# EAGLE design 6309 CPU Card Edge (EAGLE 4.16)
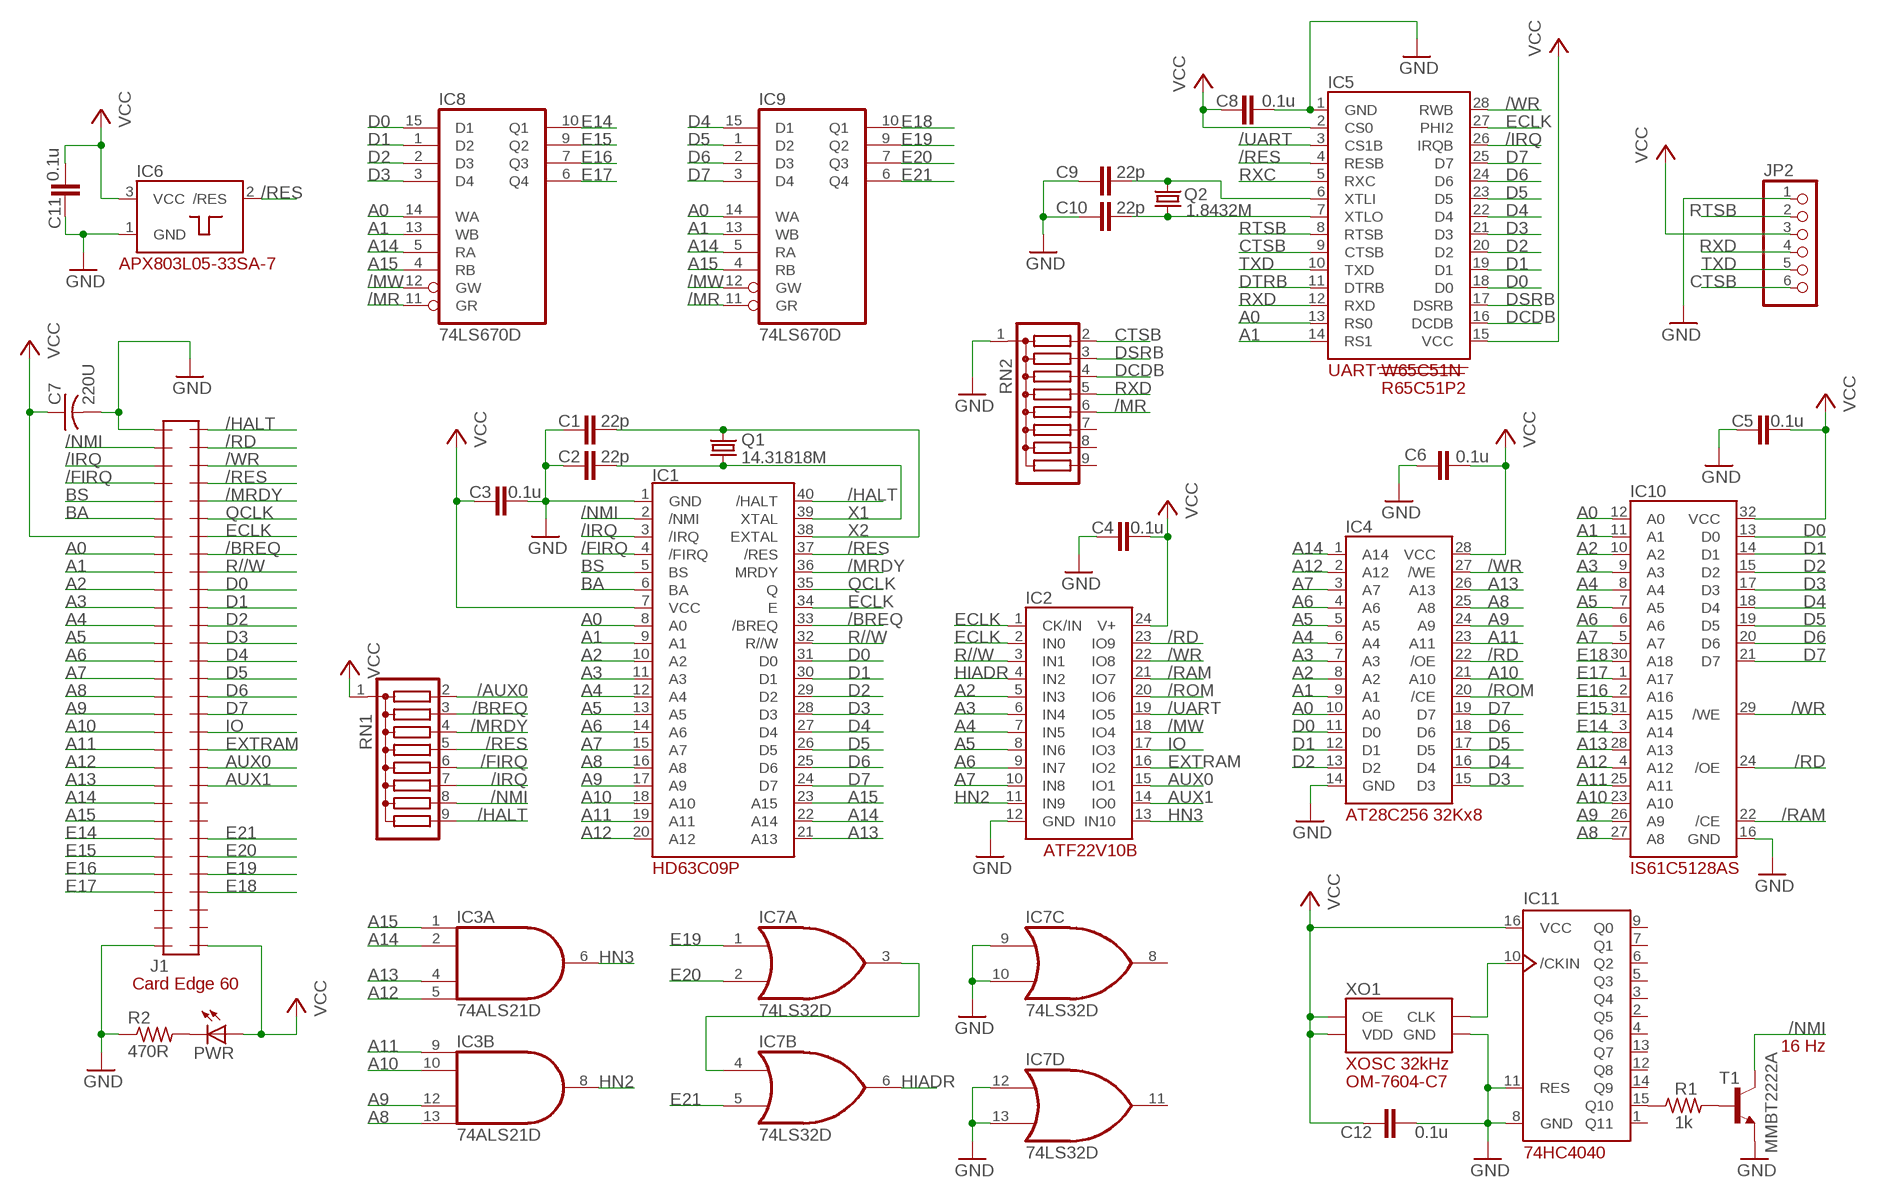
[diagram p0: schematic, sheet 1]

## Parts
C1  22p  C-EUC0603  [C0603]
C2  22p  C-EUC0603  [C0603]
C3  0.1u  C-EUC0603  [C0603]
C4  0.1u  C-EUC0603  [C0603]
C5  0.1u  C-EUC0603  [C0603]
C6  0.1u  C-EUC0603  [C0603]
C7  220U  C-US025-050X050  [C025-050X050]
C8  0.1u  C-EUC0603  [C0603]
C9  22p  C-EUC0603  [C0603]
C10  22p  C-EUC0603  [C0603]
C11  0.1u  C-EUC0603  [C0603]
C12  0.1u  C-EUC0603  [C0603]
IC1  HD63C09P  [DIL40]
IC2  PLD_ATF22V10B  [DIL24-3]
IC3  74ALS21D  [SO14]
IC4  EEP_32KX8_AT28C256  [DIL28-6]
IC5  UART_W65C51N  [DIL28-6]
IC6  POR_APX803L05-33SA-7  [SOT23]
IC7  74LS32D  [SO14]
IC8  74LS670D  [SO16]
IC9  74LS670D  [SO16]
IC10  IS61C5128AS  [SOIC32_11.3MM_WID]
IC11  74HC4040D  [SO16]
J1  CARDEDGE_2.54_60POS  [CARDEDGE_2.54_60POS]
JP2  PINHD-1X6  [1X06]
PWR  LED3MM  [LED3MM]
Q1  14.31818M  CRYSTALHC49S  [HC49/S]
Q2  1.8432M  CRYSTALHC49S  [HC49/S]
R1  1k  R-US_R0603  [R0603]
R2  470R  R-US_R0603  [R0603]
RN1  G08R  [SIL9]
RN2  G08R  [SIL9]
T1  MMBT2222A  MMBT2222ALT1-NPN-SOT23-BEC  [SOT23-BEC]
XO1  XODC_32KHZ_OM-7604-C7  [32K_XO_OM-7604-C7]

## Nets
/AUX0: RN1.2
/BREQ: IC1.33(/BREQ) J1.53 RN1.3
/FIRQ: IC1.4(/FIRQ) J1.4 RN1.6
/HALT: IC1.40(/HALT) J1.60 RN1.9
/IRQ: IC1.3(/IRQ) IC5.26(IRQB) J1.3 RN1.7
/MR: IC8.11(GR) IC9.11(GR) RN2.6
/MRDY: IC1.36(MRDY) J1.56 RN1.4
/MW: IC2.18(IO4) IC8.12(GW) IC9.12(GW)
/NMI: IC1.2(/NMI) J1.2 RN1.8 T1.C
/RAM: IC2.21(IO7) IC10.22(/CE)
/RD: IC2.23(IO9) IC4.22(/OE) IC10.24(/OE) J1.59
/RES: IC1.37(/RES) IC5.4(RESB) IC6.2(/RES) J1.57 RN1.5
/ROM: IC2.20(IO6) IC4.20(/CE)
/UART: IC2.19(IO5) IC5.3(CS1B)
/WR: IC2.22(IO8) IC4.27(/WE) IC5.28(RWB) IC10.29(/WE) J1.58
A0: IC1.8(A0) IC4.10(A0) IC5.13(RS0) IC8.14(WA) IC9.14(WA) IC10.12(A0) J1.8
A1: IC1.9(A1) IC4.9(A1) IC5.14(RS1) IC8.13(WB) IC9.13(WB) IC10.11(A1) J1.9
A2: IC1.10(A2) IC2.5(IN3) IC4.8(A2) IC10.10(A2) J1.10
A3: IC1.11(A3) IC2.6(IN4) IC4.7(A3) IC10.9(A3) J1.11
A4: IC1.12(A4) IC2.7(IN5) IC4.6(A4) IC10.8(A4) J1.12
A5: IC1.13(A5) IC2.8(IN6) IC4.5(A5) IC10.7(A5) J1.13
A6: IC1.14(A6) IC2.9(IN7) IC4.4(A6) IC10.6(A6) J1.14
A7: IC1.15(A7) IC2.10(IN8) IC4.3(A7) IC10.5(A7) J1.15
A8: IC1.16(A8) IC3.13(B:I3) IC4.25(A8) IC10.27(A8) J1.16
A9: IC1.17(A9) IC3.12(B:I2) IC4.24(A9) IC10.26(A9) J1.17
A10: IC1.18(A10) IC3.10(B:I1) IC4.21(A10) IC10.23(A10) J1.18
A11: IC1.19(A11) IC3.9(B:I0) IC4.23(A11) IC10.25(A11) J1.19
A12: IC1.20(A12) IC3.5(A:I3) IC4.2(A12) IC10.4(A12) J1.20
A13: IC1.21(A13) IC3.4(A:I2) IC4.26(A13) IC10.28(A13) J1.21
A14: IC1.22(A14) IC3.2(A:I1) IC4.1(A14) IC8.5(RA) IC9.5(RA) J1.22
A15: IC1.23(A15) IC3.1(A:I0) IC8.4(RB) IC9.4(RB) J1.23
AUX0: IC2.15(IO1) J1.41
AUX1: IC2.14(IO0) J1.40
BA: IC1.6(BA) J1.6
BS: IC1.5(BS) J1.5
CTSB: IC5.9(CTSB) JP2.6 RN2.2
D0: IC1.31(D0) IC4.11(D0) IC5.18(D0) IC8.15(D1) IC10.13(D0) J1.51
D1: IC1.30(D1) IC4.12(D1) IC5.19(D1) IC8.1(D2) IC10.14(D1) J1.50
D2: IC1.29(D2) IC4.13(D2) IC5.20(D2) IC8.2(D3) IC10.15(D2) J1.49
D3: IC1.28(D3) IC4.15(D3) IC5.21(D3) IC8.3(D4) IC10.17(D3) J1.48
D4: IC1.27(D4) IC4.16(D4) IC5.22(D4) IC9.15(D1) IC10.18(D4) J1.47
D5: IC1.26(D5) IC4.17(D5) IC5.23(D5) IC9.1(D2) IC10.19(D5) J1.46
D6: IC1.25(D6) IC4.18(D6) IC5.24(D6) IC9.2(D3) IC10.20(D6) J1.45
D7: IC1.24(D7) IC4.19(D7) IC5.25(D7) IC9.3(D4) IC10.21(D7) J1.44
DCDB: IC5.16(DCDB) RN2.4
DSRB: IC5.17(DSRB) RN2.3
DTRB: IC5.11(DTRB)
E14: IC8.10(Q1) IC10.3(A14) J1.24
E15: IC8.9(Q2) IC10.31(A15) J1.25
E16: IC8.7(Q3) IC10.2(A16) J1.26
E17: IC8.6(Q4) IC10.1(A17) J1.27
E18: IC9.10(Q1) IC10.30(A18) J1.34
E19: IC7.1(A:I0) IC9.9(Q2) J1.35
E20: IC7.2(A:I1) IC9.7(Q3) J1.36
E21: IC7.5(B:I1) IC9.6(Q4) J1.37
ECLK: IC1.34(E) IC2.1(CK/IN) IC2.2(IN0) IC5.27(PHI2) J1.54
EXTRAM: IC2.16(IO2) J1.42
GND [supply]: C1.1 C2.1 C3.2 C4.1 C5.1 C6.1 C7.2 C8.2 C9.1 C10.1 C11.2 C12.2 IC1.1(GND) IC2.12(GND) IC4.14(GND) IC5.1(GND) IC6.1(GND) IC7.9(C:I0) IC7.10(C:I1) IC7.12(D:I0) IC7.13(D:I1) IC10.16(GND) IC11.8(GND) IC11.11(RES) J1.1 J1.30 JP2.1 R2.1 RN2.1 T1.E XO1.GND
HIADR: IC2.4(IN2) IC7.6(B:O)
HN2: IC2.11(IN9) IC3.8(B:O)
HN3: IC2.13(IN10) IC3.6(A:O)
IO: IC2.17(IO3) J1.43
N$1: R1.2 T1.B
N$2: PWR.K(C) R2.2
N$3: IC11.15(Q10) R1.1
N$4: IC7.3(A:O) IC7.4(B:I0)
N$5: IC11.10(/CKIN) XO1.CKOUT(CLK)
N$20: C9.2 IC5.6(XTLI) Q2.2
N$21: C10.2 IC5.7(XTLO) Q2.1
QCLK: IC1.35(Q) J1.55
R//W: IC1.32(R//W) IC2.3(IN1) J1.52
RTSB: IC5.8(RTSB) JP2.2
RXC: IC5.5(RXC)
RXD: IC5.12(RXD) JP2.4 RN2.5
TXD: IC5.10(TXD) JP2.5
VCC [supply]: C3.1 C4.2 C5.2 C6.2 C7.1 C8.1 C11.1 C12.1 IC1.7(VCC) IC2.24(V+) IC4.28(VCC) IC5.2(CS0) IC5.15(VCC) IC6.3(VCC) IC10.32(VCC) IC11.16(VCC) J1.7 J1.31 JP2.3 PWR.A RN1.1 XO1.OE XO1.VDD
X1: C2.2 IC1.39(XTAL) Q1.1
X2: C1.2 IC1.38(EXTAL) Q1.2
Unconnected: IC7.8(C:O) IC7.11(D:O) IC11.1(Q11) IC11.2(Q5) IC11.3(Q4) IC11.4(Q6) IC11.5(Q3) IC11.6(Q2) IC11.7(Q1) IC11.9(Q0) IC11.12(Q8) IC11.13(Q7) IC11.14(Q9) J1.28 J1.29 J1.32 J1.33 J1.38 J1.39 RN2.7 RN2.8 RN2.9

## Notes on the sheet
- R65C51P2
- 16 Hz

## Power pins joined to a net without a drawn wire
GND: IC3.7(P:GND) IC7.7(P:GND) IC8.8(GND) IC9.8(GND)
VCC: IC3.14(P:VCC) IC7.14(P:VCC) IC8.16(VCC) IC9.16(VCC)

## Library data of the parts
C1-C6 C8-C12 = rcl:C-EU: CAPACITOR, European symbol
C7 = rcl:C-US: CAPACITOR, American symbol
IC1 = 07-Retrocomputing:HD63C09P
IC2 = 07-Retrocomputing:PLD_ATF22V10B
IC3 = 74xx-us:74*21: Dual 4-input AND gate
IC4 = 07-Retrocomputing:EEP_32KX8_AT28C256
IC5 = 07-Retrocomputing:UART_W65C51N
IC6 = 07-Retrocomputing:POR_APX803L05-33SA-7
IC7 = 74xx-us:74*32: Quad 2-input OR gate
IC8 IC9 = 74xx-us:74*670: 4 by 4 REGISTER FILES, 3-state
IC10 = 07-Retrocomputing:IS61C5128AS
IC11 = 07-Retrocomputing:74HC4040
J1 = 07-Retrocomputing:CARDEDGE_2.54_60POS
JP2 = pinhead:PINHD-1X6: PIN HEADER
PWR = led:LED: LED OSRAM: - CHIPLED LG R971, LG N971, LY N971, LG Q971, LY Q971, LO R971, LY R971 LH N974, LH R974 LS Q976, LO Q976, LY Q976 LO Q996 - Hyper CHIPLED LW Q18S LB Q993, LB Q99A, LB R99A - SideLED LS A670, LO A670, LY A670, LG A670, LP A670 LB A673, LV A673, LT A673, LW A673 LH A674 LY A675 LS A676, LA A676, LO A676, LY A676, LW A676 LS A679, LY A679, LG A679 - Hyper Micro SIDELED® LS Y876, LA Y876, LO Y876, LY Y876 LT Y87S - SmartLED LW L88C, LW L88S LB L89C, LB L89S, LG L890 LS L89K, LO L89K, LY L89K LS L896, LA L896, LO L896, LY L896 - TOPLED LS T670, LO T670, LY T670, LG T670, LP T670 LSG T670, LSP T670, LSY T670, LOP T670, LYG T670 LG T671, LOG T671, LSG T671 LB T673, LV T673, LT T673, LW T673 LH T674 LS T676, LA T676, LO T676, LY T676, LB T676, LH T676, LSB T676, LW T676 LB T67C, LV T67C, LT T67C, LS T67K, LO T67K, LY T67K, LW E67C LS E67B, LA E67B, LO E67B, LY E67B, LB E67C, LV E67C, LT E67C LW T67C LS T679, LY T679, LG T679 LS T770, LO T770, LY T770, LG T770, LP T770 LB T773, LV T773, LT T773, LW T773 LH T774 LS E675, LA E675, LY E675, LS T675 LS T776, LA T776, LO T776, LY T776, LB T776 LHGB T686 LT T68C, LB T68C - Hyper Mini TOPLED® LB M676 - Mini TOPLED Santana® LG M470 LS M47K, LO M47K, LY M47K Source: http://www.osram.convergy.de - LUMILED® LXK2-PW12-R00, LXK2-PW12-S00, LXK2-PW14-U00, LXK2-PW14-V00 LXK2-PM12-R00, LXK2-PM12-S00, LXK2-PM14-U00 LXK2-PE12-Q00, LXK2-PE12-R00, LXK2-PE12-S00, LXK2-PE14-T00, LXK2-PE14-U00 LXK2-PB12-K00, LXK2-PB12-L00, LXK2-PB12-M00, LXK2-PB14-N00, LXK2-PB14-P00, LXK2-PB14-Q00 LXK2-PR12-L00, LXK2-PR12-M00, LXK2-PR14-Q00, LXK2-PR14-R00 LXK2-PD12-Q00, LXK2-PD12-R00, LXK2-PD12-S00 LXK2-PH12-R00, LXK2-PH12-S00 LXK2-PL12-P00, LXK2-PL12-Q00, LXK2-PL12-R00 Source: www.luxeon.com
Q1 Q2 = crystal:CRYSTAL: CRYSTAL
R1 R2 = rcl:R-US_: RESISTOR, American symbol
RN1 RN2 = resistor-sil:G08R: SIL RESISTOR
T1 = transistor:*-NPN-: NPN Transistror
XO1 = 07-Retrocomputing:XODC_32KHZ_OM-7604-C7

## Net classes
0 default: width 0.203 mm, drill 0.203 mm, clearance 0.254 mm
1 supply: width 0.61 mm, drill 0.203 mm, clearance 0.305 mm

## Board
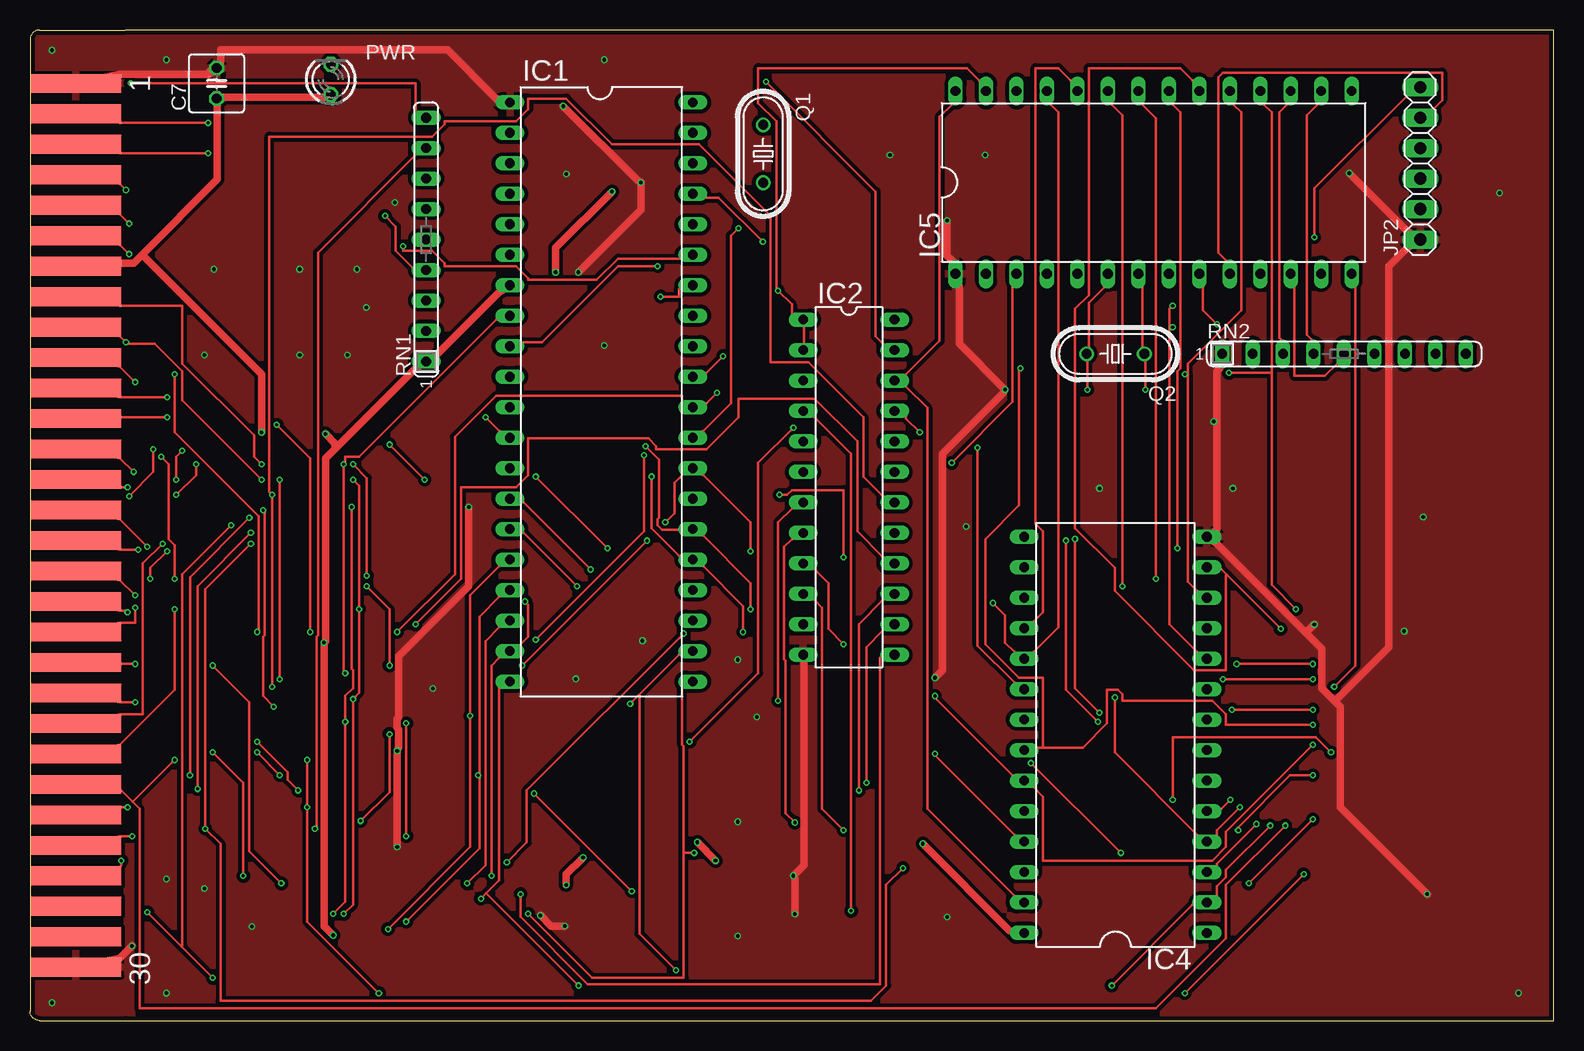
[diagram p1: board, top side]
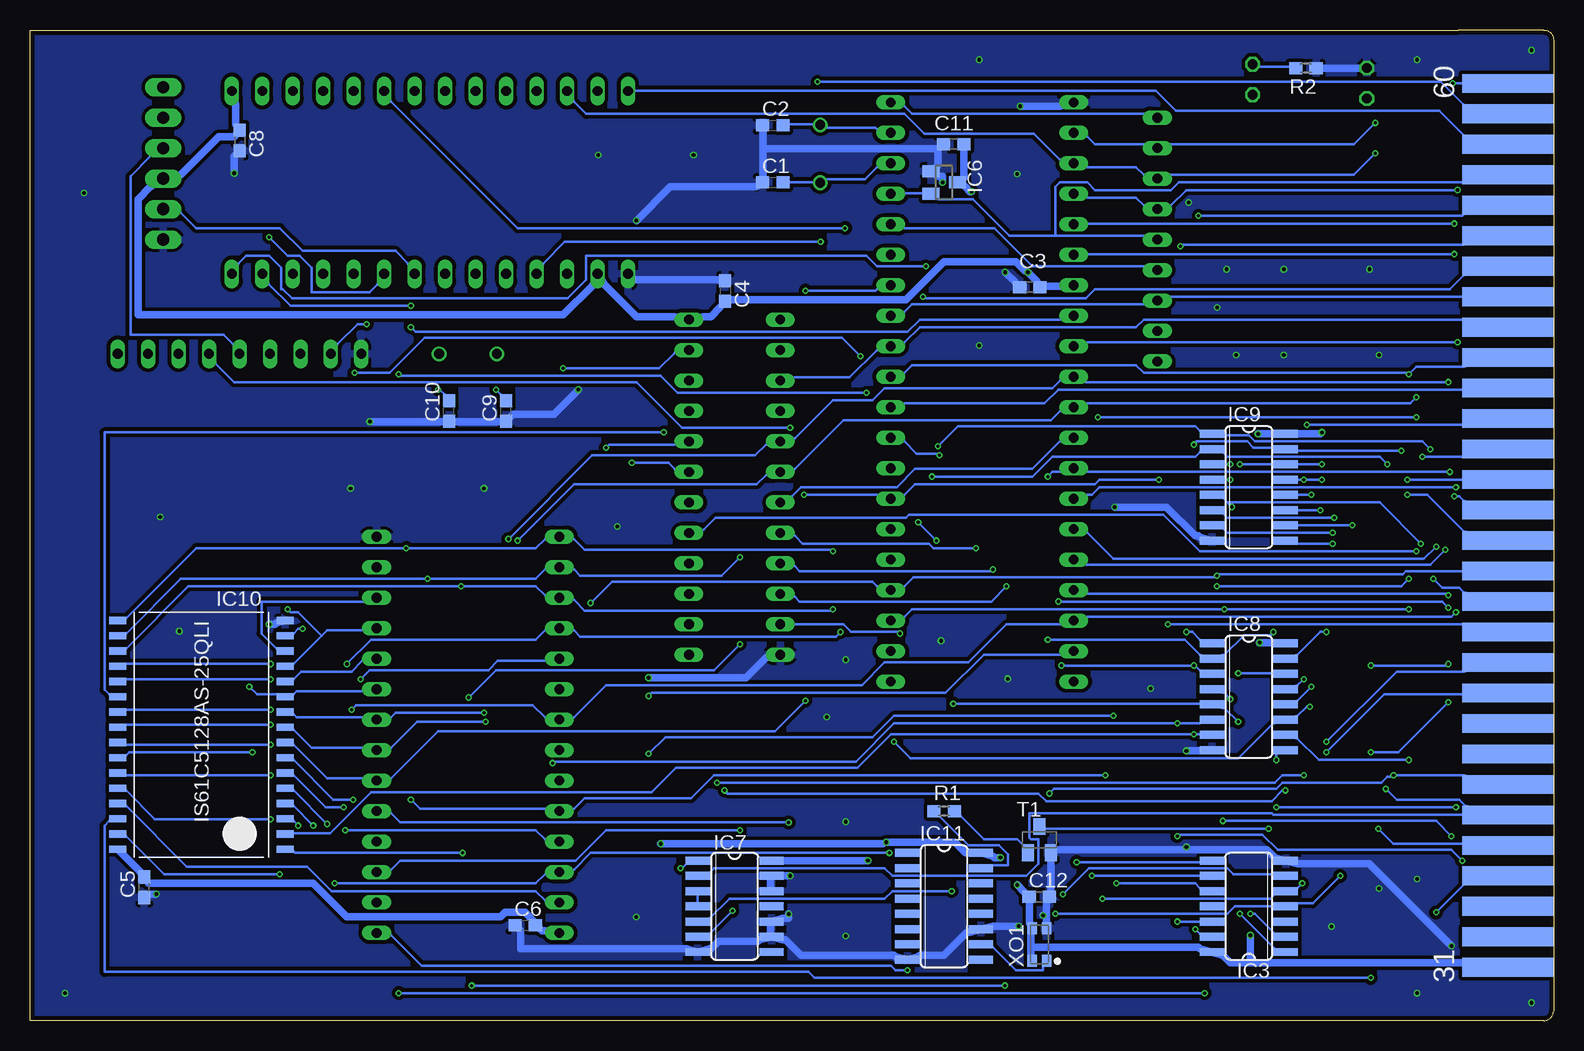
[diagram p2: board, bottom side, seen from below]

Size 127 x 82.55 mm. Coordinates in mm from the lower left corner, seen from the top.
Outline: 7.94,0 127,0 127,82.55 7.94,82.55
Copper layers (1*16): Top 0.0356mm / dielectric 1.6mm / Bottom 0.0356mm
Design rules "oshpark-2layer": minimum track width 6mil, minimum drill 10mil, track to track 6mil, track to pad 6mil, pad to pad 6mil, via to via 6mil, smd to smd 6mil, copper to edge 15mil, drill to drill 6mil, minimum pad ring 5mil, minimum via ring 5mil, stop-mask expansion 2.5mil, vias tented up to drill 0mil, thermal gap 10mil

### Footprints (pad centres in the part's own frame; a part is rotated, then mirrored left to right if it is on the bottom)
C0603 = smd 1.1 x 1: 1 -0.85,0; 2 0.85,0
C025-050X050 = drill 0.813 octagon: 1 -1.27,0; 2 1.27,0
DIL40 = drill 0.813 long: 1 -24.13,-7.62; 2 -21.59,-7.62; 3 -19.05,-7.62; 4 -16.51,-7.62; 5 -13.97,-7.62; 6 -11.43,-7.62; 7 -8.89,-7.62; 8 -6.35,-7.62; 9 -3.81,-7.62; 10 -1.27,-7.62; 11 1.27,-7.62; 12 3.81,-7.62; 13 6.35,-7.62; 14 8.89,-7.62; 15 11.43,-7.62; 16 13.97,-7.62; 17 16.51,-7.62; 18 19.05,-7.62; 19 21.59,-7.62; 20 24.13,-7.62; 21 24.13,7.62; 22 21.59,7.62; 23 19.05,7.62; 24 16.51,7.62; 25 13.97,7.62; 26 11.43,7.62; 27 8.89,7.62; 28 6.35,7.62; 29 3.81,7.62; 30 1.27,7.62; 31 -1.27,7.62; 32 -3.81,7.62; 33 -6.35,7.62; 34 -8.89,7.62; 35 -11.43,7.62; 36 -13.97,7.62; 37 -16.51,7.62; 38 -19.05,7.62; 39 -21.59,7.62; 40 -24.13,7.62
DIL24-3 = drill 0.813 long: 1 -13.97,-3.81; 2 -11.43,-3.81; 3 -8.89,-3.81; 4 -6.35,-3.81; 5 -3.81,-3.81; 6 -1.27,-3.81; 7 1.27,-3.81; 8 3.81,-3.81; 9 6.35,-3.81; 10 8.89,-3.81; 11 11.43,-3.81; 12 13.97,-3.81; 13 13.97,3.81; 14 11.43,3.81; 15 8.89,3.81; 16 6.35,3.81; 17 3.81,3.81; 18 1.27,3.81; 19 -1.27,3.81; 20 -3.81,3.81; 21 -6.35,3.81; 22 -8.89,3.81; 23 -11.43,3.81; 24 -13.97,3.81
SO14 = smd 0.66 x 2.032: 1 -3.81,-3.073; 2 -2.54,-3.073; 3 -1.27,-3.073; 4 0,-3.073; 5 1.27,-3.073; 6 2.54,-3.073; 7 3.81,-3.073; 8 3.81,3.073; 9 2.54,3.073; 10 1.27,3.073; 11 0,3.073; 12 -1.27,3.073; 13 -2.54,3.073; 14 -3.81,3.073
DIL28-6 = drill 0.813 long: 1 -16.51,-7.62; 2 -13.97,-7.62; 3 -11.43,-7.62; 4 -8.89,-7.62; 5 -6.35,-7.62; 6 -3.81,-7.62; 7 -1.27,-7.62; 8 1.27,-7.62; 9 3.81,-7.62; 10 6.35,-7.62; 11 8.89,-7.62; 12 11.43,-7.62; 13 13.97,-7.62; 14 16.51,-7.62; 15 16.51,7.62; 16 13.97,7.62; 17 11.43,7.62; 18 8.89,7.62; 19 6.35,7.62; 20 3.81,7.62; 21 1.27,7.62; 22 -1.27,7.62; 23 -3.81,7.62; 24 -6.35,7.62; 25 -8.89,7.62; 26 -11.43,7.62; 27 -13.97,7.62; 28 -16.51,7.62
SOT23 = smd 1 x 1.4: 1 -0.95,-1.1; 2 0.95,-1.1; 3 0,1.1
SO16 = smd 0.66 x 2.032: 1 -4.445,-3.073; 2 -3.175,-3.073; 3 -1.905,-3.073; 4 -0.635,-3.073; 5 0.635,-3.073; 6 1.905,-3.073; 7 3.175,-3.073; 8 4.445,-3.073; 9 4.445,3.073; 10 3.175,3.073; 11 1.905,3.073; 12 0.635,3.073; 13 -0.635,3.073; 14 -1.905,3.073; 15 -3.175,3.073; 16 -4.445,3.073
SOIC32_11.3MM_WID = smd 1.4 x 0.6: 1 -6.985,9.525; 2 -6.985,8.255; 3 -6.985,6.985; 4 -6.985,5.715; 5 -6.985,4.445; 6 -6.985,3.175; 7 -6.985,1.905; 8 -6.985,0.635; 9 -6.985,-0.635; 10 -6.985,-1.905; 11 -6.985,-3.175; 12 -6.985,-4.445; 13 -6.985,-5.715; 14 -6.985,-6.985; 15 -6.985,-8.255; 16 -6.985,-9.525; 17 6.985,-9.525; 18 6.985,-8.255; 19 6.985,-6.985; 20 6.985,-5.715; 21 6.985,-4.445; 22 6.985,-3.175; 23 6.985,-1.905; 24 6.985,-0.635; 25 6.985,0.635; 26 6.985,1.905; 27 6.985,3.175; 28 6.985,4.445; 29 6.985,5.715; 30 6.985,6.985; 31 6.985,8.255; 32 6.985,9.525
CARDEDGE_2.54_60POS = smd 1.556 x 7.62: 1 -36.83,3.81; 2 -34.29,3.81; 3 -31.75,3.81; 4 -29.21,3.81; 5 -26.67,3.81; 6 -24.13,3.81; 7 -21.59,3.81; 8 -19.05,3.81; 9 -16.51,3.81; 10 -13.97,3.81; 11 -11.43,3.81; 12 -8.89,3.81; 13 -6.35,3.81; 14 -3.81,3.81; 15 -1.27,3.81; 16 1.27,3.81; 17 3.81,3.81; 18 6.35,3.81; 19 8.89,3.81; 20 11.43,3.81; 21 13.97,3.81; 22 16.51,3.81; 23 19.05,3.81; 24 21.59,3.81; 25 24.13,3.81; 26 26.67,3.81; 27 29.21,3.81; 28 31.75,3.81; 29 34.29,3.81; 30 36.83,3.81 | smd 1.556 x 7.62 bottom: 31 36.83,3.81; 32 34.29,3.81; 33 31.75,3.81; 34 29.21,3.81; 35 26.67,3.81; 36 24.13,3.81; 37 21.59,3.81; 38 19.05,3.81; 39 16.51,3.81; 40 13.97,3.81; 41 11.43,3.81; 42 8.89,3.81; 43 6.35,3.81; 44 3.81,3.81; 45 1.27,3.81; 46 -1.27,3.81; 47 -3.81,3.81; 48 -6.35,3.81; 49 -8.89,3.81; 50 -11.43,3.81; 51 -13.97,3.81; 52 -16.51,3.81; 53 -19.05,3.81; 54 -21.59,3.81; 55 -24.13,3.81; 56 -26.67,3.81; 57 -29.21,3.81; 58 -31.75,3.81; 59 -34.29,3.81; 60 -36.83,3.81
1X06 = drill 1.016 long: 1 -6.35,0; 2 -3.81,0; 3 -1.27,0; 4 1.27,0; 5 3.81,0; 6 6.35,0
LED3MM = drill 0.813 octagon: A -1.27,0; K 1.27,0
HC49/S = drill 0.813 round: 1 -2.413,0; 2 2.413,0
R0603 = smd 1.1 x 1: 1 -0.85,0; 2 0.85,0
SIL9 = drill 0.813 long: 1 -10.16,0; 2 -7.62,0; 3 -5.08,0; 4 -2.54,0; 5 0,0; 6 2.54,0; 7 5.08,0; 8 7.62,0; 9 10.16,0
SOT23-BEC = smd 1 x 1.4: B -0.95,-1.1; C 0,1.1; E 0.95,-1.1
32K_XO_OM-7604-C7 = smd 1 x 0.8: CKOUT -1.35,-0.6; GND 1.35,-0.6; OE 1.35,0.6; VDD -1.35,0.6

### Placement (x,y rotation side)
C1  65.09,69.85 0 bottom
C2  65.09,74.61 0 bottom
C3  43.66,61.12 180 bottom
C4  69.06,60.8 270 bottom
C5  117.47,11.11 90 bottom
C6  85.72,7.94 0 bottom
C7  15.56,78.11 90 top
C8  109.54,73.34 270 bottom
C9  87.31,50.8 90 bottom
C10  92.08,50.8 90 bottom
C11  50.01,73.03 180 bottom
C12  42.86,10.32 0 bottom
IC1  47.62,52.39 270 top
IC2  68.26,44.45 270 top
IC3  25.4,9.53 90 bottom
IC4  90.49,23.81 90 top
IC5  93.66,69.85 0 top
IC6  50.8,69.85 270 bottom
IC7  68.26,9.53 270 bottom
IC8  25.4,26.99 270 bottom
IC9  25.4,44.45 270 bottom
IC10  112.71,23.81 180 bottom
IC11  50.8,9.53 270 bottom
J1  0,41.27 270 top
JP2  115.89,71.44 90 top
PWR  25.08,78.42 90 top
Q1  61.12,72.23 270 top
Q2  90.49,55.56 180 top
R1  50.8,17.46 0 bottom
R2  20.64,79.38 180 bottom
RN1  33.02,65.09 90 top
RN2  109.54,55.56 0 top
T1  42.86,15.08 0 bottom
XO1  42.86,6.35 90 bottom

### Tracks (layer width: path | path; a pad name or v marks a point on that pad's centre or on a via)
/BREQ
  Bottom 0.203: IC1.33 54.1,59.05 53.47,59.69 34.16,59.69 RN1.3 31.88,60.33 J1.53
/FIRQ  (via drill 0.25)
  Top 0.203: v8,69.22 7.49,69.72 J1.4
  Bottom 0.203: IC1.4 38.86,68.58 34.8,68.58 34.16,67.94 RN1.6 31.88,67.94 30.61,69.22 v8,69.22
/HALT  (via drill 0.25)
  Top 0.203: v8.38,78.11 32.13,78.11 32.13,75.82 RN1.9
  Bottom 0.203: RN1.9 34.16,75.56 53.47,75.56 54.1,76.2 IC1.40 | J1.60 v8.38,78.11
/IRQ  (via drill 0.25)
  Top 0.203: v14.86,72.26 7.49,72.26 J1.3
  Bottom 0.203: IC5.26 81.66,76.58 80.64,75.56 54.1,75.56 52.45,73.91 43.31,73.91 41.15,71.75 IC1.3 38.86,71.12 34.8,71.12 34.16,70.48 RN1.7 31.88,70.48 16.64,70.48 v14.86,72.26
/MR  (via drill 0.25)
  Top 0.203: v20.32,26.16 19.43,27.05 19.43,32 19.56,32.13 19.56,42.42 v19.43,42.55 | v63.63,49.4 60.71,46.48 60.71,28.96 v54.99,23.24
  Bottom 0.203: v20.32,26.16 20.57,26.16 21.34,25.4 IC8.11 23.24,24.77 23.37,24.77 26.29,21.84 53.59,21.84 v54.99,23.24 | v19.43,42.55 IC9.11 | v63.63,49.4 72.64,49.4 76.45,53.21 109.98,53.21 111.51,54.74 RN2.6
/MRDY  (via drill 0.25)
  Top 0.203: v29.59,67.06 30.48,66.17 30.48,64.14 31.88,62.74 RN1.4
  Bottom 0.203: RN1.4 34.16,62.87 43.43,62.87 46.61,66.04 54.1,66.04 IC1.36 | v29.59,67.06 7.62,67.06 7.49,67.18 J1.56
/MW  (via drill 0.25)
  Top 0.203: v20.19,27.81 v20.19,43.81 19.94,44.07 19.94,73.66 33.53,73.66 34.54,74.68 34.54,74.93 40.51,74.93 41.53,75.95 41.53,76.83 44.7,76.83 48.51,73.03 55.75,73.03 61.72,67.06 61.72,54.86 64.9,54.86 69.47,50.29 69.47,45.34 71.12,43.69 IC2.18
  Bottom 0.203: v20.19,27.81 21.34,26.67 IC8.12 | v20.19,43.81 IC9.12
/NMI  (via drill 0.25)
  Top 0.203: v23.75,16 23.88,16.13 23.88,32 24,32.13 24,64.01 32.13,72.14 RN1.8 | v14.86,74.8 7.49,74.8 J1.2
  Bottom 0.203: v23.75,16 42.42,16 T1.C | IC1.2 38.86,73.66 38.23,73.03 34.16,73.03 RN1.8 31.88,73.03 16.64,73.03 v14.86,74.8
/RAM  (via drill 0.25)
  Top 0.203: v74.17,49.02 73.03,50.16 73.03,50.29 IC2.21
  Bottom 0.203: v74.17,49.02 120.78,49.02 120.78,27.56 120.4,27.18 IC10.22
/RD  (via drill 0.25)
  Top 0.203: v106.93,24.64 99.69,24.64 99.69,25.53 98.55,26.67 91.06,26.67 91.06,27.18 90.68,27.56 89.79,27.56 89.79,24.77 87.76,22.73 84.45,22.73 | 84.45,22.73 84.07,22.73 IC4.22 | v82.55,54.36 82.42,54.23 82.42,42.93 79.63,40.13 79.63,31.37 82.42,28.57 84.45,28.57 84.45,22.73 | v61.34,78.23 70.48,69.09 70.48,57.02 71.12,56.39 IC2.23
  Bottom 0.203: v106.93,24.64 119,24.64 IC10.24 | v82.55,54.36 74.55,54.36 73.28,55.63 IC2.23 | v61.34,78.23 9.4,78.23 7.49,76.33 J1.59
/RES  (via drill 0.25)
  Top 0.203: v61.09,64.9 57.4,68.58 56.39,68.58 IC1.37
  Bottom 0.203: IC1.37 54.1,68.96 52.58,68.96 IC6.2 51.31,68.45 48.39,68.45 45.34,65.41 41.53,65.41 | 41.53,65.41 34.16,65.41 RN1.5 | v61.09,64.9 82.42,64.9 84.2,63.12 IC5.4 | 41.53,65.41 41.53,69.47 41.15,69.85 38.86,69.85 38.23,69.22 31.88,69.22 31.24,69.85 7.49,69.85 J1.57
/ROM  (via drill 0.25)
  Top 0.203: v78.99,47.75 78.99,31.24 82.04,28.19 IC4.20
  Bottom 0.203: v78.99,47.75 78.74,48.01 73.28,48.01 IC2.20
/UART  (via drill 0.25)
  Top 0.203: v76.83,46.48 81.92,51.56 81.92,61.09 IC5.3
  Bottom 0.203: v76.83,46.48 73.79,46.48 73.28,45.97 IC2.19
/WR
  Top 0.203: IC5.28 76.83,76.33 75.82,75.31 75.82,56.64 73.03,53.85 IC2.22 73.03,52.83 74.8,51.05 74.8,17.65 82.04,10.41 IC4.27
  Bottom 0.203: IC10.29 119,17.91 113.92,12.83 103.89,12.83 101.85,10.79 84.84,10.79 84.07,10.03 IC4.27 | J1.58 7.49,73.79 9.53,75.82 31.5,75.82 33.15,77.47 IC5.28
A0  (via drill 0.25)
  Top 0.203: v95.25,59.56 95,59.31 95,57.78 | 95,57.78 95,33.02 97.28,30.73 IC4.10 | v26.29,28.96 26.16,29.08 v26.16,46.35 26.29,46.48 26.29,46.99 27.43,46.99 38.86,58.42 IC1.8 | v19.3,46.35 18.67,46.99 18.67,48.77 12.7,54.74 12.7,59.56 7.49,59.56 J1.8 | v95.25,57.78 95,57.78
  Bottom 0.203: IC10.12 105.03,28.45 104.39,29.08 100.2,29.08 99.31,29.97 IC4.10 | v95.25,59.56 105.28,59.56 107.06,61.34 IC5.13 | v26.29,28.96 23.24,28.96 IC8.14 | v26.16,46.35 IC9.14 v19.3,46.35 | v95.25,57.78 94.87,57.4 53.85,57.4 52.83,58.42 41.15,58.42 IC1.8
A1  (via drill 0.25)
  Top 0.203: v108.71,27.81 110.49,29.59 110.49,61.09 IC5.14 | v20.83,28.45 v20.83,45.09 | J1.9 7.49,57.02 v8,56.52 8.13,56.39 10.41,56.39 12.7,54.1 12.7,51.69 v19.3,45.09 | v52.32,62.87 49.02,62.87 42.67,56.52 41.15,56.52 IC1.9
  Bottom 0.203: IC4.9 99.31,27.43 104.78,27.43 105.03,27.18 IC10.11 106.43,27.18 108.08,27.18 v108.71,27.81 | v20.83,28.45 21.34,27.94 IC8.13 | IC9.13 v20.83,45.09 v19.3,45.09 | v8,56.52 38.86,56.52 IC1.9 | v52.32,62.87 56.39,62.87 57.28,63.75 80.64,63.75 80.64,61.72 82.17,60.2 105.16,60.2 105.92,60.96 106.05,60.96 106.05,62.74 107.06,63.75 108.97,63.75 109.6,63.12 IC5.14
A2  (via drill 0.25)
  Top 0.203: v89.15,25.65 87.12,27.69 v87.12,40.13 | v8.76,53.21 7.49,54.48 J1.10
  Bottom 0.203: IC10.10 105.03,25.53 104.78,25.27 99.31,25.27 IC4.8 96.9,25.27 96.52,25.65 v89.15,25.65 | v87.12,40.13 80.14,47.12 66.55,47.12 65.66,48.01 IC2.5 63.25,48.51 60.07,51.69 56.77,51.69 55.75,52.7 41.78,52.7 41.15,53.34 IC1.10 38.99,53.21 v8.76,53.21
A3  (via drill 0.25)
  Top 0.203: v89.03,24.89 86.36,27.56 v86.36,40.01 | v11.43,51.94 7.49,51.94 J1.11
  Bottom 0.203: IC10.9 105.03,24.26 103.5,22.73 99.31,22.73 IC4.7 96.9,22.73 94.74,24.89 v89.03,24.89 | v86.36,40.01 81.66,44.7 66.42,44.7 65.66,45.47 IC2.6 63.25,45.97 59.18,50.04 41.91,50.04 41.15,50.8 IC1.11 38.86,51.44 11.94,51.44 v11.43,51.94
A4  (via drill 0.25)
  Top 0.203: v62.36,26.67 62.36,41.53 63.5,42.67 IC2.7 | v11.43,50.29 7.49,50.29 J1.12 | v37.97,50.29 39.12,49.15 IC1.12
  Bottom 0.203: IC10.8 105.03,22.99 102.23,20.19 99.31,20.19 IC4.6 96.9,20.19 92.96,24.13 64.9,24.13 v62.36,26.67 | IC1.12 41.15,48.26 43.43,45.97 53.21,45.97 54.74,44.45 62.74,44.45 63.5,43.69 IC2.7 | v11.43,50.29 v37.97,50.29
A5  (via drill 0.25)
  Top 0.203: v100.08,18.41 99.31,17.65 IC4.5 | v8.64,45.72 7.49,46.86 J1.13 | v42.16,45.34 v48.13,39.37 | v63.75,16.51 62.99,17.27 62.99,29.97 62.87,30.1 62.87,39.5 63.5,40.13 IC2.8
  Bottom 0.203: v100.08,18.41 101.73,18.41 105.03,21.72 IC10.7 | v8.64,45.72 38.86,45.72 IC1.13 41.15,45.72 41.78,45.72 v42.16,45.34 | v48.13,39.37 51.69,39.37 52.07,39.75 62.61,39.75 63.25,40.39 IC2.8 | v63.75,16.51 96.14,16.51 96.9,17.27 IC4.5
A6  (via drill 0.25)
  Top 0.203: v100.84,17.78 98.93,15.88 98.93,15.49 IC4.4 97.28,15.49 90.42,22.35 v90.42,26.92 | v46.74,37.59 41.15,43.18 IC1.14 | v67.82,31.37 66.55,32.64 66.55,36.45 65.41,37.59 IC2.9 | v8.13,44.45 7.49,44.45 J1.14
  Bottom 0.203: v100.84,17.78 102.36,17.78 105.03,20.45 IC10.6 | v46.74,37.59 46.86,37.47 62.87,37.47 63.25,37.85 IC2.9 | v90.42,26.92 88.14,29.21 69.98,29.21 v67.82,31.37 | v8.13,44.45 37.85,44.45 38.48,43.81 38.86,43.81 IC1.14
A7  (via drill 0.25)
  Top 0.203: v102.23,16.38 98.93,13.08 98.93,12.95 IC4.3 | v45.59,36.2 41.15,40.64 IC1.15 | v67.82,15.88 66.04,17.65 66.04,34.42 65.41,35.05 IC2.10 | v9.78,39.5 7.49,41.78 J1.15
  Bottom 0.203: v102.23,16.38 105.03,19.18 IC10.5 | v45.59,36.2 46.86,34.92 62.87,34.92 63.25,35.31 IC2.10 | v67.82,15.88 78.99,15.88 81.53,13.34 96.14,13.34 96.9,12.57 IC4.3 | v9.78,39.5 10.79,38.48 36.7,38.48 38.86,40.64 IC1.15
A8  (via drill 0.25)
  Top 0.203: v106.93,20.45 105.03,20.45 100.71,16.13 v100.71,15.88 | v29.84,7.62 36.7,14.48 v36.7,25.4 36.7,35.43 39.12,37.85 IC1.16 | v9.02,39.24 7.49,39.24 J1.16 | v75.44,22.23 75.44,22.1 82.04,15.49 IC4.25
  Bottom 0.203: v106.93,20.45 119,20.45 IC10.27 | v100.71,15.88 84.84,15.88 84.07,15.11 IC4.25 | v29.84,7.62 29.46,7.24 IC3.13 | v9.02,39.24 10.29,37.97 38.99,37.97 IC1.16 | v75.44,22.23 74.04,23.62 56.77,23.62 54.99,25.4 v36.7,25.4
A9  (via drill 0.25)
  Top 0.203: v108.46,22.35 107.19,23.62 95.25,23.62 v95.25,18.41 | v31.37,8.26 37.47,14.35 37.47,20.45 | 37.47,20.45 37.47,33.66 39.12,35.31 IC1.17 | v8.76,35.43 7.49,36.7 J1.17 | 37.47,20.45 v37.34,20.45
  Bottom 0.203: v108.46,22.35 118.75,22.35 119,22.1 IC10.26 | v95.25,18.41 94.49,17.65 84.07,17.65 IC4.24 81.66,17.65 80.77,18.54 71.88,18.54 69.98,20.45 v37.34,20.45 | IC3.12 v31.37,8.26 | v8.76,35.43 8.89,35.56 38.86,35.56 IC1.17
A10  (via drill 0.25)
  Top 0.203: v100.2,25.91 v106.93,25.91 | v36.45,11.43 37.97,12.95 37.97,31.62 39.12,32.77 IC1.18 | v8.13,34.04 8.13,34.16 7.49,34.16 J1.18
  Bottom 0.203: v106.93,25.91 119,25.91 IC10.23 | v100.2,25.91 99.82,26.29 85.09,26.29 84.07,25.27 IC4.21 81.66,25.27 78.99,27.94 57.66,27.94 55.75,29.84 48.77,29.84 45.59,33.02 41.15,33.02 IC1.18 38.86,33.66 8.51,33.66 v8.13,34.04 | v36.45,11.43 29.84,11.43 29.46,11.05 IC3.10
A11  (via drill 0.25)
  Top 0.203: v106.93,22.99 99.69,15.75 99.69,14.48 98.55,13.34 84.45,13.34 84.45,18.67 83.69,19.43 IC4.23 81.92,20.45 75.44,26.92 v75.44,27.05 | v38.48,12.06 38.48,29.59 39.12,30.23 IC1.19 40.89,31.37 41.53,32 41.53,34.67 v41.27,34.92 | v8.76,34.42 8.76,33.15 7.49,33.15 J1.19
  Bottom 0.203: v106.93,22.99 119,22.99 IC10.25 | v38.48,12.06 IC3.9 | v8.76,34.42 9.27,34.92 v41.27,34.92 | v75.44,27.05 75.18,27.3 50.67,27.3 47.5,30.48 41.15,30.48 IC1.19
A12  (via drill 0.25)
  Top 0.203: v103.38,16.26 99.69,12.57 99.69,11.94 98.93,11.18 98.93,10.41 IC4.2 96.9,9.65 v90.17,2.92 | 38.04,10.6 39.12,11.68 39.12,27.69 IC1.20 | v37.59,10.16 38.04,10.6 | 38.04,10.6 v45.72,2.92 | v8.76,29.72 7.49,29.72 J1.20 | v15.24,29.59 18.29,26.54 18.29,14.1 v20.95,11.43
  Bottom 0.203: v103.38,16.26 105.03,17.91 IC10.4 | v37.59,10.16 23.62,10.16 23.24,10.54 IC3.5 21.34,11.05 v20.95,11.43 | v45.72,2.92 v90.17,2.92 | v8.76,29.72 8.89,29.59 v15.24,29.59
A13  (via drill 0.25)
  Top 0.203: v101.6,11.43 v106.93,16.76 | v41.53,8.89 46.86,3.56 54.48,3.56 54.48,13.97 | 54.48,13.97 54.48,22.86 54.36,22.99 54.36,27.69 IC1.21 | v8.76,26.54 7.49,26.54 J1.21 | v15.24,22.35 17.78,19.81 v17.78,12.06 | 54.48,13.97 v55.37,13.97
  Bottom 0.203: v106.93,16.76 116.59,16.76 119,19.18 IC10.28 | v101.6,11.43 84.84,11.43 84.07,12.19 IC4.26 81.66,12.57 80.26,13.97 v55.37,13.97 | v41.53,8.89 27.18,8.89 26.54,9.53 IC3.4 21.34,9.78 20.07,9.78 v17.78,12.06 | v8.76,26.54 12.95,22.35 v15.24,22.35
A14  (via drill 0.25)
  Top 0.203: v25.27,8.89 26.29,9.91 v26.29,24.89 26.29,27.05 26.92,27.69 26.92,29.21 26.8,29.34 v26.8,42.8 | v50.04,26.42 50.74,27.11 | 50.74,27.11 54.1,30.48 IC1.22 | v53.85,4.19 50.8,7.24 50.8,27.05 50.74,27.11 | v11.05,39.75 9.4,38.1 9.4,25.53 7.49,25.53 J1.22
  Bottom 0.203: v25.27,8.89 24.89,8.89 23.24,7.24 IC3.2 | v26.29,24.89 27.43,26.04 27.56,26.04 IC8.5 29.46,26.42 v50.04,26.42 | v26.8,42.8 27.11,43.12 | 27.11,43.12 27.56,43.56 IC9.5 | v53.85,4.19 54.86,4.19 55.24,4.57 94.36,4.57 96.9,7.11 IC4.1 | v11.05,39.75 14.48,43.18 27.05,43.18 27.11,43.12
A15  (via drill 0.25)
  Top 0.203: v26.16,8.89 26.92,9.65 v26.92,26.8 27.43,27.3 v27.43,34.29 27.43,44.58 v26.92,45.09 | v12.06,34.29 12.06,27.56 7.49,22.99 J1.23
  Bottom 0.203: v26.16,8.89 23.24,5.97 IC3.1 | v26.92,26.8 27.43,27.3 27.56,27.3 IC8.4 | v26.92,45.09 IC9.4 | IC1.23 54.1,33.66 53.47,34.29 v27.43,34.29 v12.06,34.29
AUX0  (via drill 0.25)
  Top 0.203: v69.09,19.18 69.09,33.02 71.12,35.05 IC2.15 | v22.35,19.18 21.46,20.07 21.46,20.7 v18.92,23.24
  Bottom 0.203: v69.09,19.18 68.83,18.92 42.93,18.92 42.29,18.29 23.5,18.29 22.61,19.18 v22.35,19.18 | v18.92,23.24 13.08,29.08 7.49,29.08 J1.41
AUX1  (via drill 0.25)
  Top 0.203: v69.72,19.81 69.72,31.11 71.12,32.51 IC2.14 | v18.92,22.35 v20.83,20.45
  Bottom 0.203: v69.72,19.81 23.24,19.81 22.61,20.45 v20.83,20.45 | v18.92,22.35 14.1,27.18 7.49,27.18 J1.40
BA  (via drill 0.25)
  Top 0.203: v8.26,63.88 7.49,64.64 J1.6
  Bottom 0.203: v8.26,63.88 38.86,63.88 IC1.6
BS  (via drill 0.25)
  Top 0.203: v8.26,66.42 7.49,67.18 J1.5
  Bottom 0.203: v8.26,66.42 38.86,66.42 IC1.5
CTSB  (via drill 0.25)
  Top 0.203: v98.93,58.04 97.79,59.18 97.79,61.09 IC5.9 | v107.06,65.28 107.06,69.34 114.81,77.09 JP2.6
  Bottom 0.203: v98.93,58.04 99.69,58.04 101.35,56.39 RN2.2 | v107.06,65.28 105.54,63.75 104.52,63.75 103.5,62.74 103.5,60.71 98.68,60.71 98.04,61.34 IC5.9
D0  (via drill 0.25)
  Top 0.203: 103.5,53.98 103.5,36.32 v105.54,34.29 | 103.5,53.98 103.5,75.69 102.87,76.33 IC5.18 | v18.92,32.38 19.05,32.51 19.05,42.04 12.06,49.02 v12.06,53.85 | v99.95,53.98 103.5,53.98 | v57.78,55.37 56.39,53.98 IC1.31
  Bottom 0.203: 102.68,32.07 102.23,32.51 99.31,32.51 IC4.11 | 102.68,32.07 105.03,29.72 IC10.13 | v105.54,34.29 105.28,34.04 104.65,34.04 102.68,32.07 | v18.92,32.38 19.43,32.38 21.34,30.48 IC8.15 | J1.51 7.49,54.48 11.43,54.48 v12.06,53.85 12.19,53.98 34.16,53.98 34.8,54.61 53.47,54.61 54.1,53.98 IC1.31 | v99.95,53.98 97.03,53.98 94.11,56.9 59.31,56.9 v57.78,55.37
D1  (via drill 0.25)
  Top 0.203: 96.52,53.85 96.52,36.58 97.28,35.81 IC4.12 | 96.52,53.85 96.52,54.74 100.97,59.18 100.97,75.69 100.33,76.33 IC5.19 | v30.61,32.38 35.43,37.21 35.43,48.64 38.86,52.07 54.36,52.07 54.36,51.69 IC1.30 56.39,51.44 v57.28,52.32 | v96.27,53.85 96.52,53.85
  Bottom 0.203: IC10.14 106.43,30.99 107.7,32.26 107.7,34.92 99.19,34.92 IC4.12 | v30.61,32.38 30.1,32.38 29.46,31.75 IC8.1 | J1.50 7.49,52.58 41.27,52.58 42.42,51.44 54.1,51.44 IC1.30 | v96.27,53.85 96.14,53.72 74.42,53.72 73.03,52.32 v57.28,52.32
D2  (via drill 0.25)
  Top 0.203: 99.76,37.15 99.31,37.59 IC4.13 | 99.76,37.15 v104.27,32.64 | IC5.20 96.9,78.36 95.89,79.38 88.27,79.38 88.27,60.45 87.12,59.31 87.12,41.02 90.42,37.72 90.42,35.81 97.03,29.21 99.69,29.21 99.69,37.08 99.76,37.15 | v42.16,31.75 51.18,40.77 v51.18,47.12 | v20.57,49.66 23.37,46.86 v23.37,32.38 | v59.05,66.04 58.42,65.41 58.42,51.44 56.13,49.15 IC1.29
  Bottom 0.203: v104.27,32.64 104.65,32.64 105.03,32.26 IC10.15 | v42.16,31.75 30.73,31.75 29.46,30.48 IC8.2 27.56,30.48 27.43,30.48 25.78,32.13 23.62,32.13 v23.37,32.38 | v51.18,47.12 51.31,47.24 53.09,47.24 54.1,48.26 IC1.29 | v20.57,49.66 7.49,49.66 J1.49 | v59.05,66.04 86.36,66.04 96.9,76.58 IC5.20
D3  (via drill 0.25)
  Top 0.203: v41.02,29.59 v51.44,40.01 | v52.96,41.53 53.72,42.29 53.72,44.83 54.36,45.47 IC1.28 56.13,45.47 60.07,41.53 v60.07,39.12 | v10.92,46.99 11.56,46.35 11.56,40.13 12.06,39.62 v12.06,36.83 | v28.07,36.2 29.97,34.29 v29.97,29.59 | v95.63,39.37 95.63,54.1 95.89,54.36 95.89,75.69 95.25,76.33 IC5.21
  Bottom 0.203: v41.02,29.59 v29.97,29.59 29.84,29.59 29.46,29.21 IC8.3 | v51.44,40.01 v52.96,41.53 | v10.92,46.99 7.49,46.99 J1.48 | v12.06,36.83 12.7,36.2 v28.07,36.2 | IC10.17 119,33.53 113.16,39.37 v95.63,39.37 84.84,39.37 84.07,40.13 IC4.15 81.66,40.13 80.77,39.24 60.2,39.24 v60.07,39.12
D4  (via drill 0.25)
  Top 0.203: v12.7,47.5 12.19,46.99 v12.19,45.09 | v29.97,48.01 v32.89,45.09 | v93.85,36.83 93.85,75.18 92.71,76.33 IC5.22 | v62.48,43.81 63.12,43.81 63.5,44.2 67.82,44.2 v67.82,38.61
  Bottom 0.203: v12.7,47.5 21.34,47.5 IC9.15 23.24,47.75 25.02,47.75 25.53,48.26 29.72,48.26 v29.97,48.01 | J1.47 v12.19,45.09 | v32.89,45.09 37.85,45.09 38.23,44.7 53.21,44.7 54.1,43.81 IC1.27 56.39,43.81 v62.48,43.81 | IC10.18 119,32.26 114.43,36.83 v93.85,36.83 84.84,36.83 84.07,37.59 IC4.16 81.66,37.59 81.15,37.08 69.34,37.08 v67.82,38.61
D5  (via drill 0.25)
  Top 0.203: v51.31,47.88 52.45,46.74 52.45,41.91 52.32,41.78 52.32,41.27 52.7,40.89 54.1,40.89 IC1.26 56.13,40.39 60.07,36.45 v60.07,34.29 | v8.26,43.69 10.29,45.72 v10.29,47.62 | v91.06,36.2 91.06,75.44 90.17,76.33 IC5.23
  Bottom 0.203: v51.31,47.88 49.66,49.53 29.84,49.53 29.46,49.15 IC9.1 27.56,48.77 25.4,48.77 24.89,48.26 10.92,48.26 v10.29,47.62 | v8.26,43.69 7.87,43.69 7.49,43.31 J1.46 | IC10.19 119,30.99 113.79,36.2 v91.06,36.2 84.84,36.2 84.07,35.43 IC4.17 81.66,35.05 80.77,34.16 60.2,34.16 v60.07,34.29
D6  (via drill 0.25)
  Top 0.203: v51.82,45.34 51.82,41.02 54.1,38.73 IC1.25 56.13,37.85 59.44,34.54 v59.44,32.38 | v12.19,43.81 13.84,45.47 v13.84,46.35 | v100.58,29.72 v106.93,29.72 | IC5.24 86.74,78.36 85.72,79.38 83.82,79.38 83.82,41.4 84.45,40.77 84.45,34.04 83.69,33.27 IC4.18
  Bottom 0.203: v51.82,45.34 43.43,45.34 41.78,46.99 29.84,46.99 29.46,47.37 IC9.2 27.56,47.37 27.18,46.99 14.48,46.99 v13.84,46.35 | v12.19,43.81 10.54,43.81 7.49,40.77 J1.45 | v106.93,29.72 119,29.72 IC10.20 | v100.58,29.72 98.55,31.75 84.84,31.75 84.07,32.51 IC4.18 81.66,32.51 81.15,32 59.82,32 v59.44,32.38
D7  (via drill 0.25)
  Top 0.203: v26.92,46.35 28.07,45.21 v28.07,37.08 | v99.44,28.45 v106.93,28.45 | IC5.25 85.09,76.33 85.72,75.69 85.72,32.77 83.69,30.73 IC4.19 82.04,30.73 81.28,31.5 81.28,33.78 v80.26,34.8
  Bottom 0.203: v26.92,46.35 IC9.3 | J1.44 12.32,37.47 12.57,37.21 27.94,37.21 v28.07,37.08 28.19,36.96 53.34,36.96 54.1,36.2 IC1.24 56.39,36.2 56.77,36.58 78.49,36.58 v80.26,34.8 | v106.93,28.45 119,28.45 IC10.21 | v99.44,28.45 98.68,29.21 88.77,29.21 88.01,29.97 84.07,29.97 IC4.19
DCDB
  Top 0.203: RN2.4 106.81,56.77 106.43,57.15 106.43,75.44 107.31,76.33 IC5.16
DSRB
  Top 0.203: RN2.3 104.27,56.77 104.14,56.9 104.14,75.69 104.78,76.33 IC5.17
E14  (via drill 0.25)
  Top 0.203: v104.65,16.26 99.69,11.3 99.69,6.86 93.85,1.02 9.14,1.02 9.14,17.65 8.57,18.22 | 8.57,18.22 7.49,19.3 J1.24 | 8.57,18.22 v12.06,21.72
  Bottom 0.203: v104.65,16.26 105.03,16.64 IC10.3 | v12.06,21.72 19.56,21.72 21.34,23.5 IC8.10
E15  (via drill 0.25)
  Top 0.203: v96.27,2.29 v106.17,12.19 | v29.08,2.29 23.11,8.26 v23.11,17.78 v23.11,21.72 | v8.13,17.78 7.49,17.78 J1.25
  Bottom 0.203: v106.17,12.19 115.82,12.19 119,15.37 IC10.31 | v29.08,2.29 v96.27,2.29 | v23.11,21.72 23.11,22.23 IC8.9 | v8.13,17.78 v23.11,17.78
E16  (via drill 0.25)
  Top 0.203: v8.51,15.37 7.49,15.37 J1.26 | v27.56,16.64 29.97,19.05 v29.97,23.88
  Bottom 0.203: IC10.2 105.03,15.62 101.98,15.62 98.55,19.05 75.18,19.05 73.15,21.08 58.04,21.08 55.24,23.88 v29.97,23.88 29.46,23.88 IC8.7 | v8.51,15.37 9.78,16.64 v27.56,16.64
E17  (via drill 0.25)
  Top 0.203: v83.44,21.46 v90.93,13.97 | v7.62,13.34 7.62,12.95 7.49,12.83 J1.27 | v31.37,15.37 v31.37,24.77
  Bottom 0.203: v90.93,13.97 104.9,13.97 105.03,14.1 IC10.1 | v83.44,21.46 83.31,21.59 58.17,21.59 54.99,24.77 v31.37,24.77 29.46,24.77 IC8.6 | v7.62,13.34 8.51,14.22 22.99,14.22 24.26,15.49 31.24,15.49 v31.37,15.37
E18  (via drill 0.25)
  Top 0.203: v9.78,9.02 12.64,6.16 | 12.64,6.16 v15.24,3.56 | v16.76,41.27 12.7,37.21 12.7,6.22 12.64,6.16
  Bottom 0.203: v15.24,3.56 61.59,3.56 62.1,4.06 120.78,4.06 120.78,16.26 120.4,16.64 IC10.30 | v9.78,9.02 7.49,11.3 J1.34 | v16.76,41.27 IC9.10
E19  (via drill 0.25)
  Top 0.203: v18.41,39.75 14.61,35.94 v14.61,16 15.88,14.73 15.88,1.65 70.1,1.65 71.37,2.92 71.37,11.3 v72.77,12.7
  Bottom 0.203: v18.41,39.75 21.34,39.75 IC9.9 | v14.61,16 13.34,14.73 7.49,14.73 J1.35 | v72.77,12.7 72.64,12.7 72.26,13.08 IC7.1
E20  (via drill 0.25)
  Top 0.203: v18.41,40.64 13.97,36.2 v13.97,19.3
  Bottom 0.203: v18.41,40.64 27.18,40.64 27.56,41.02 IC9.7 | v13.97,19.3 13.08,18.41 7.87,18.41 7.37,17.91 J1.36 23.37,17.14 23.5,17.27 43.69,17.27 43.69,15.24 43.56,15.11 42.93,15.11 42.93,13.08 43.94,12.06 55.12,12.06 55.75,12.7 69.98,12.7 70.36,12.32 IC7.2
E21  (via drill 0.25)
  Top 0.203: v18.29,41.91 13.34,36.96 v13.34,20.45 | v42.04,18.92 v50.16,10.79
  Bottom 0.203: v18.29,41.91 27.18,41.91 27.56,42.29 IC9.6 | J1.37 7.49,20.45 v13.34,20.45 13.46,20.32 13.84,20.32 14.35,19.81 22.61,19.81 23.11,19.3 41.66,19.3 v42.04,18.92 | v50.16,10.79 55.12,10.79 55.75,10.16 68.71,10.16 70.36,8.51 IC7.5
ECLK  (via drill 0.25)
  Top 0.203: IC2.2 64.52,56.39 64.52,57.91 IC2.1 63.5,58.93 63.5,59.69 v62.36,60.83 62.23,60.96 62.23,74.93 60.71,76.45 60.71,79.38 78.11,79.38 79.12,78.36 IC5.27 | v52.58,60.33 54.1,60.33 54.1,60.96 IC1.34
  Bottom 0.203: v62.36,60.83 56.52,60.83 56.39,60.96 IC1.34 | v52.58,60.33 52.45,60.2 38.99,60.2 38.23,60.96 8.64,60.96 7.49,62.1 J1.54
EXTRAM  (via drill 0.25)
  Top 0.203: v32.13,33.02 35.94,36.83 35.94,44.45 40.51,44.45 41.53,45.47 41.53,48.51 51.56,48.51 52.2,47.88 52.2,47.62 56.39,47.62 59.05,50.29 59.05,51.82 65.41,51.82 68.96,48.26 68.96,40.77 71.12,38.61 IC2.16
  Bottom 0.203: v32.13,33.02 7.49,33.02 J1.42
GND  (via drill 0.3)
  Top 0.61: IC2.12 64.52,29.97 64.52,12.95 v63.63,12.06 63.75,11.81 v63.75,8.89 | v30.61,14.48 v30.61,22.48 30.73,22.73 30.73,24.26 30.61,24.38 30.61,25.15 30.73,25.27 30.73,30.35 36.58,36.2 v36.58,42.8 | v8.51,6.22 7.49,5.21 J1.30 | v44.58,7.87 43.43,7.87 v42.55,8.76 | v109.98,70.61 114.81,65.79 JP2.1 114.81,64.39 113.28,62.87 113.28,31.11 108.78,26.61 | v116.46,10.54 109.22,17.78 109.22,26.16 108.78,26.61 | 108.78,26.61 107.7,27.69 107.7,30.99 106.36,32.32 | 106.36,32.32 98.93,39.75 IC4.14 98.93,40.89 98.93,49.91 | 106.36,32.32 v107.06,33.02 | 98.93,49.91 98.93,54.1 99.19,54.36 RN2.1 | v98.68,49.91 98.93,49.91 | v45.72,62.36 50.93,67.56 v50.93,69.85 50.67,69.98 v44.45,76.2 | v76.45,66.67 76.45,63.75 76.83,63.37 IC5.1 77.47,61.09 77.47,56.39 v81.28,52.58 81.15,52.32 76.07,47.24 76.07,29.21 v75.44,28.57 | IC1.1 38.86,76.83 34.8,80.9 15.88,80.9 15.88,79.88 C7.2 14.99,79.12 14.99,78.87 7.49,78.87 J1.1
  Bottom 0.61: IC7.12 65.28,11.05 65.28,11.81 IC7.13 v63.63,12.06 | IC7.9 65.28,7.24 65.28,8 IC7.10 64.26,8.51 63.75,8.51 v63.75,8.89 | C6.1 86.11,7.49 86.11,5.97 72.26,5.97 IC7.7 70.36,5.97 70.23,5.97 69.6,6.6 66.29,6.6 66.17,6.73 IC7.9 | IC7.9 64.26,6.73 64.01,6.73 62.74,5.46 54.99,5.46 54.86,5.33 IC11.8 52.96,5.33 52.83,5.46 50.8,5.46 48.9,7.37 48.64,7.37 IC11.11 46.74,7.87 v44.58,7.87 | 42.29,8.76 42.29,9.91 C12.2 41.91,10.79 41.91,13.34 T1.E 41.53,14.22 30.61,14.22 | 42.29,8.76 42.29,8.13 XO1.GND | 30.61,14.22 23.88,14.22 23.24,13.59 IC3.7 21.34,13.08 15.37,13.08 v8.51,6.22 | v30.61,22.48 29.46,22.48 IC8.8 | 30.61,14.22 v30.61,14.48 | v36.58,42.8 32.26,42.8 29.84,40.39 29.59,40.39 29.46,40.26 IC9.8 | 42.29,8.76 v42.55,8.76 | v109.98,70.61 109.98,72.01 C8.2 | v116.46,10.54 117.09,10.54 C5.1 | v107.06,33.02 106.55,33.02 106.43,33.15 IC10.16 | v98.68,49.91 92.46,49.91 C10.1 91.69,49.91 87.76,49.91 C9.1 86.87,50.42 86.74,50.55 83.31,50.55 v81.28,52.58 | C4.1 69.47,61.72 76.58,61.72 IC5.1 | 65.91,72.64 65.91,74.17 C2.1 | 65.91,72.64 65.91,70.23 C1.1 66.42,69.47 73.66,69.47 v76.45,66.67 | v45.72,62.36 44.96,61.59 C3.2 | v50.93,69.85 50.93,70.36 51.31,70.36 IC6.1 51.31,71.25 51.31,72.64 | 51.31,72.64 C11.2 | 65.91,72.64 51.31,72.64 | C7.2 R2.1 | v44.45,76.2 41.15,76.2 IC1.1 | v75.44,28.57 67.31,28.57 65.66,30.23 IC2.12
  other vias: 114.55,32.45 116.14,41.97 76.45,8.64 58.99,7.05 11.37,2.29 11.37,11.81 11.37,80.07 47.88,80.07 44.7,70.55 71.69,72.14 79.63,72.14 122.49,68.96 124.08,2.29 58.99,16.57 58.99,30.07 89.15,44.35 100.27,44.35 78.04,41.18 60.58,25.3 27.24,62.61 26.45,55.47 14.54,11.02 18.51,7.84 28.04,59.44 47.88,56.26 51.05,31.65 45.5,28.48 33.59,27.69 15.34,62.61 14.54,55.47 22.48,55.47 22.48,62.61 30.42,68.17 1.84,80.87 1.84,1.49
  pour Top: 127,82.55 0,82.55 0,0 127,0
  pour Bottom: 0,82.55 0,0 127,0 127,82.55
HIADR  (via drill 0.25)
  Top 0.203: v68.45,9.14 68.45,47.24 65.41,50.29 IC2.4
  Bottom 0.203: v68.45,9.14 70.36,7.24 IC7.6
HN2  (via drill 0.25)
  Top 0.203: v39.75,13.21 41.4,14.86 41.4,19.18 v54.48,32.26
  Bottom 0.203: v39.75,13.21 29.46,13.21 IC3.8 | v54.48,32.26 54.61,32.38 58.55,32.38 59.18,33.02 IC2.11
HN3  (via drill 0.25)
  Top 0.203: v40.89,10.54 40.89,8.64 46.48,3.05 70.87,3.05 70.87,30.23 IC2.13
  Bottom 0.203: v40.89,10.54 38.73,12.7 27.18,12.7 26.67,12.19 23.24,12.19 IC3.6
IO  (via drill 0.25)
  Top 0.203: v11.43,39.12 10.03,37.72 v10.03,36.83
  Bottom 0.203: v11.43,39.12 29.46,39.12 32.51,42.16 53.72,42.16 53.98,41.91 69.85,41.91 70.87,40.89 IC2.17 | v10.03,36.83 9.27,36.07 7.87,36.07 7.49,35.69 J1.43
N$1
  Bottom 0.203: R1.2 49.4,17.02 47.5,15.11 44.7,15.11 44.2,14.61 T1.B
N$2
  Bottom 0.203: R2.2 21.97,79.5 24.51,79.5 PWR.K
N$3
  Bottom 0.203: R1.1 51.18,17.02 48.77,14.61 46.23,14.61 45.47,13.84 45.47,12.95 46.74,12.95 IC11.15
N$4
  Bottom 0.203: IC7.4 71.37,9.78 71.37,10.54 IC7.3
N$5
  Bottom 0.203: XO1.CKOUT 42.55,4.57 42.55,4.19 44.83,4.19 46.74,6.1 IC11.10
N$20  (via drill 0.25)
  Top 0.203: v88.14,52.58 88.14,54.99 Q2.2 88.27,56.13 88.27,59.82 89.53,61.09 IC5.6
  Bottom 0.203: v88.14,52.58 87.76,52.2 C9.2
N$21  (via drill 0.25)
  Top 0.203: v92.96,52.58 92.96,54.99 Q2.1 92.71,56.13 92.71,61.09 IC5.7
  Bottom 0.203: v92.96,52.58 92.84,52.58 92.46,52.2 C10.2
QCLK  (via drill 0.25)
  Top 0.203: v31.11,64.52 31.11,64.14 33.53,64.14 34.54,63.12 34.54,62.87 40.51,62.87 41.53,61.85 41.53,61.72 47.24,61.72 49.02,63.5 54.1,63.5 IC1.35
  Bottom 0.203: v31.11,64.52 30.99,64.64 7.49,64.64 J1.55
R//W
  Bottom 0.203: IC2.3 63.25,53.59 58.67,53.59 56.39,55.88 IC1.32 54.1,56.52 52.83,57.78 34.8,57.78 34.16,58.42 7.49,58.42 J1.52
RTSB
  Bottom 0.203: IC5.8 95.5,63.12 96.52,64.14 104.27,64.14 106.17,66.04 113.16,66.04 114.43,67.31 JP2.2
RXD
  Top 0.203: RN2.5 108.97,54.74 107.95,53.72 105.41,53.72 105.41,61.09 IC5.12
  Bottom 0.203: JP2.4 116.97,72.01 118.62,70.36 118.62,57.15 110.87,57.15 110.11,56.39 RN2.5
TXD
  Top 0.203: IC5.10 99.69,63.37 99.06,64.01 99.06,78.61 99.44,78.99 117.73,78.99 117.73,76.71 116.97,75.95 JP2.5
VCC  (via drill 0.3)
  Top 0.61: v46.1,13.59 44.7,12.19 v44.7,11.3 | v55.63,14.86 v57.15,13.34 | v74.42,14.73 81.66,7.49 IC4.28 | PWR.A 24.51,76.96 16.13,76.96 C7.1 15.62,76.33 15.62,70.1 9.34,63.82 | 9.34,63.82 8.64,63.12 7.49,63.12 J1.7 | 25.59,47.82 32.13,54.36 RN1.1 33.91,55.5 39.12,60.71 IC1.7 | 25.59,47.82 24.64,46.86 24.64,31.62 v24.51,31.5 24.51,7.87 v25.27,7.11 | v24.64,48.9 25.4,48.13 25.4,48.01 25.59,47.82 | v48.51,69.09 43.81,64.39 v43.81,62.36 | v19.3,49.02 19.3,53.85 9.34,63.82
  Bottom 0.61: IC10.32 117.86,12.45 C5.2 117.09,11.43 103.38,11.43 100.58,8.64 87.76,8.64 87.38,9.02 85.72,9.02 85.09,8.38 C6.2 84.33,7.49 84.07,7.49 IC4.28 | 43.56,6.1 43.56,7.24 XO1.OE 43.69,8.13 43.69,9.91 C12.1 44.2,10.79 v44.7,11.3 | 43.56,6.1 43.56,5.46 XO1.VDD | 43.56,6.1 29.59,6.1 29.46,5.97 IC3.14 27.56,5.46 26.92,4.83 25.27,4.83 | v46.1,13.59 46.61,13.59 46.74,13.72 IC11.16 49.02,13.97 49.91,14.86 v55.63,14.86 55.88,14.73 v74.42,14.73 | v57.15,13.34 IC7.14 | 25.27,4.83 7.49,4.83 J1.31 | v24.51,31.5 23.24,31.5 IC8.16 | v24.64,48.9 IC9.16 19.43,48.9 v19.3,49.02 | IC5.15 109.86,76.33 109.86,74.68 C8.1 109.98,73.66 111.25,73.66 114.43,70.48 JP2.3 116.97,69.47 117.98,68.45 117.98,58.8 82.55,58.8 80.14,61.21 IC5.2 79.12,61.34 76.45,58.67 73.28,58.67 IC2.24 70.87,58.67 70.23,58.67 69.47,59.44 C4.2 68.58,60.07 53.98,60.07 50.8,63.25 44.83,63.25 44.07,62.48 v43.81,62.36 43.05,61.59 C3.1 42.29,61.21 41.15,61.21 IC1.7 | C11.1 49.15,72.64 49.15,70.23 IC6.3 49.02,69.47 48.64,69.09 v48.51,69.09 | 25.27,4.83 v25.27,7.11
X1
  Bottom 0.203: C2.2 63.75,74.68 61.72,74.68 Q1.1 60.58,74.42 56.52,74.42 56.39,74.3 IC1.39
X2
  Bottom 0.203: C1.2 61.72,69.85 Q1.2 60.58,70.1 57.4,70.1 56.39,71.12 IC1.38